# Altium schematic sheet MECHANICAL.SchDoc
size A4; DocumentNumber: 4; SheetNumber: 4; SheetTotal: 19
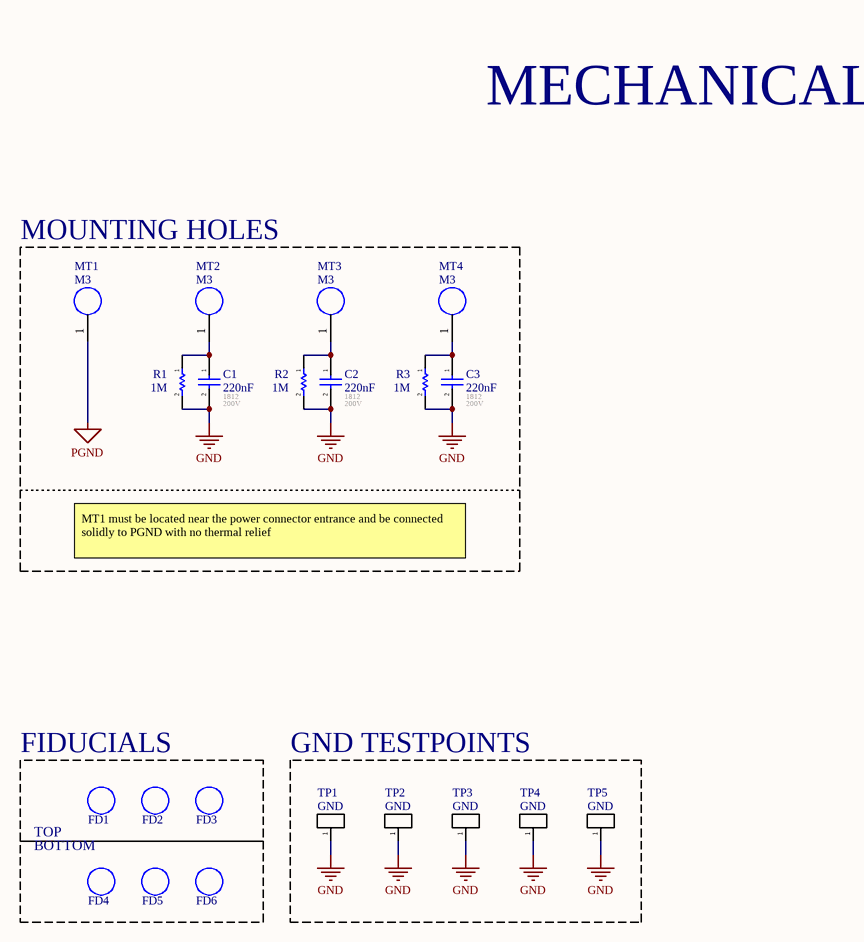
[diagram p0: MECHANICAL.SchDoc]

## Parts
C1  220nF  Voltage - Rated: 200V  Footprint: 1812  [CAP_1812]
C2  220nF  Voltage - Rated: 200V  Footprint: 1812  [CAP_1812]
C3  220nF  Voltage - Rated: 200V  Footprint: 1812  [CAP_1812]
FD1  FIDUCIAL  [FIDUCIAL]  (value not drawn)  (no BOM)
FD2  FIDUCIAL  [FIDUCIAL]  (value not drawn)  (no BOM)
FD3  FIDUCIAL  [FIDUCIAL]  (value not drawn)  (no BOM)
FD4  FIDUCIAL  [FIDUCIAL]  (value not drawn)  (no BOM)
FD5  FIDUCIAL  [FIDUCIAL]  (value not drawn)  (no BOM)
FD6  FIDUCIAL  [FIDUCIAL]  (value not drawn)  (no BOM)
MT1  M3  [MTH_M3]
MT2  M3  [MTH_M3]
MT3  M3  [MTH_M3]
MT4  M3  [MTH_M3]
R1  1M  [RES_0402]
R2  1M  [RES_0402]
R3  1M  [RES_0402]
TP1  GND  [TP_HOLE]  (no BOM)
TP2  GND  [TP_HOLE]  (no BOM)
TP3  GND  [TP_HOLE]  (no BOM)
TP4  GND  [TP_HOLE]  (no BOM)
TP5  GND  [TP_HOLE]  (no BOM)

## Blocks framed on the sheet
MOUNTING HOLES: C1-C3 MT1-MT4 R1-R3
FIDUCIALS: FD1-FD6
GND TESTPOINTS: TP1-TP5

## Nets
GND: C1.2 C2.2 C3.2 R1.2 R2.2 R3.2 TP1.1(A) TP2.1(A) TP3.1(A) TP4.1(A) TP5.1(A)
PGND: MT1.1
NetC1_1: C1.1 MT2.1 R1.1
NetC2_1: C2.1 MT3.1 R2.1
NetC3_1: C3.1 MT4.1 R3.1

## Notes on the sheet
- MECHANICAL
- MT1 must be located near the power connector entrance and be connected solidly to PGND with no thermal relief
- (near FD4) BOTTOM
- TOP

## Library data of the parts
C1-C3 = CAP_CER: Generic SMT Ceramic Capacitor; Operating Temperature: *; Tolerance: *; Mfr: *; ComponentLink1Description: Digikey; ComponentLink1URL: [Digikey Link]; Digikey Part No: *; ComponentLink2Description: Datasheet; ComponentLink2URL: [Datasheet Link]
MT1-MT4 = MOUNTING_HOLE
R1-R3 = RESISTOR: Power: 1/16W; Tolerance: 10%; Automotive: *; Operating Temperature: *; # Digikey: *; ComponentLink1Description: Digikey; ComponentLink1URL: *; # Manufacturer: *; Package / Case: 0603
TP1-TP5 = TESTPOINT: Test Point